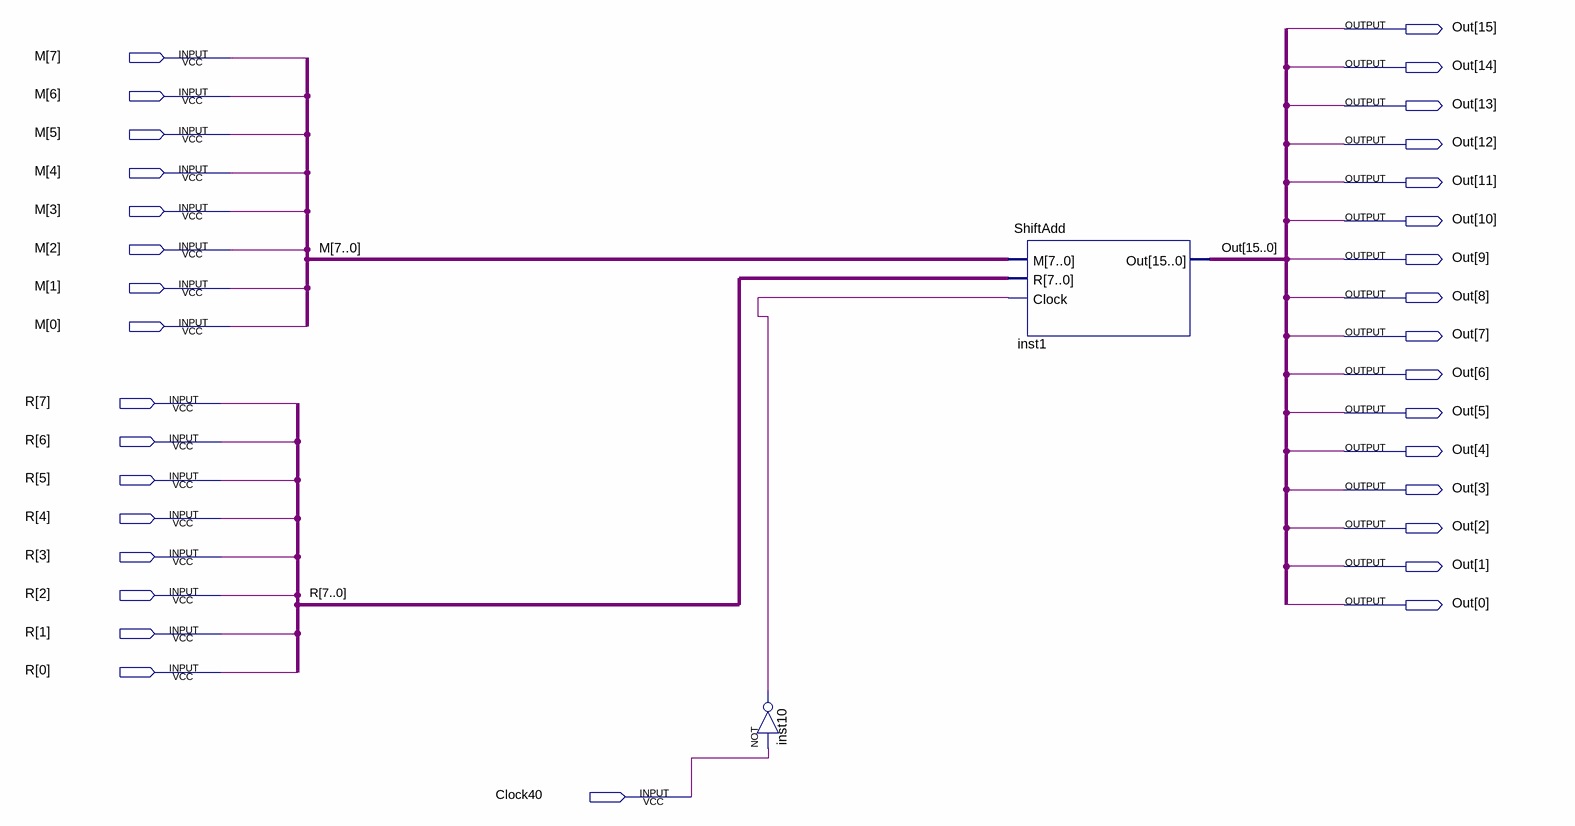
[diagram p0: schematic sheet]
// Quartus schematic test.bdf as structural Verilog: 2 symbols, 33 pins
module test (
  input  [7:0] M,
  input  [7:0] R,
  input  Clock40,
  output [15:0] Out
);

  wire inst10_out;

  not inst10 (inst10_out, Clock40);
  ShiftAdd inst1 (.M(M), .R(R), .Clock(inst10_out), .Out(Out));
endmodule
